# EasyEDA schematic SCH_Gateway.json
TITLE: Gateway Schematic; REV: 1.0; Date: 2024-02-15; Sheet: 1/1; Drawn By: Ashley Kanyatte; Company: University of Regina
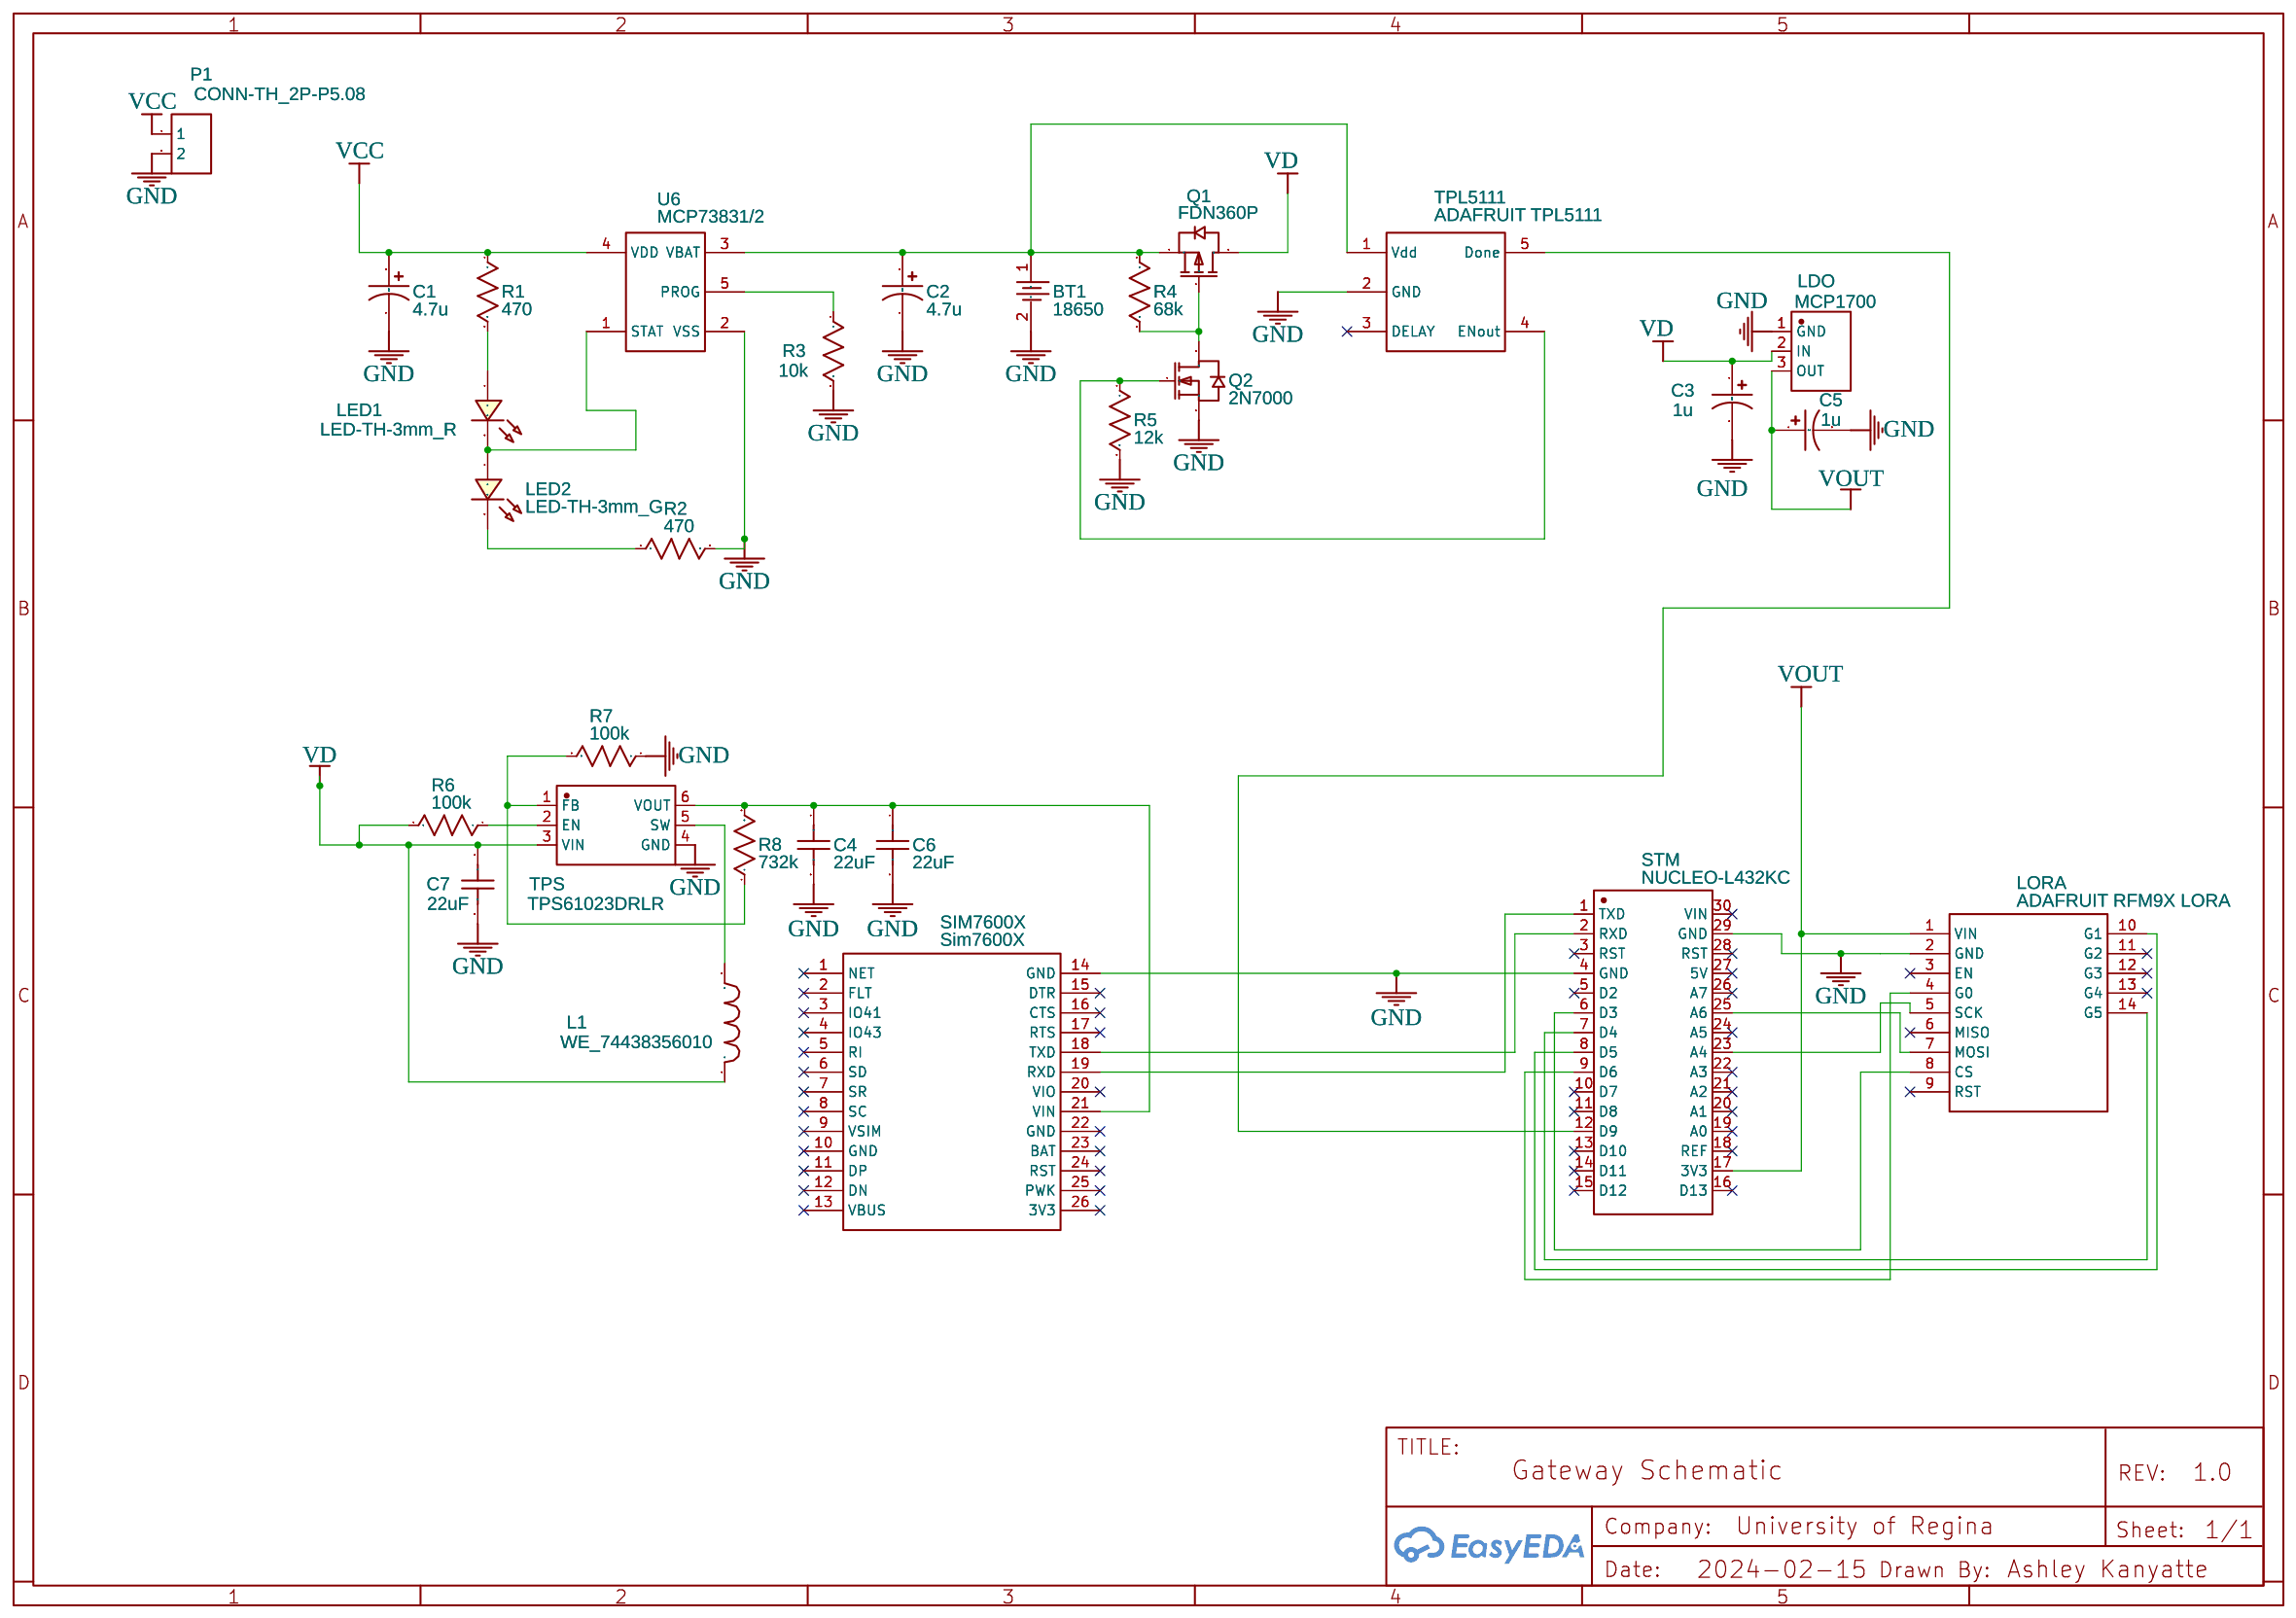
[diagram p0: schematic sheet]

## Parts
BT1  18650  [BAT-TH_18650-A5BJ001]
C1  4.7u  [CAP-D5.0×F2.0]
C2  4.7u  [CAP-D5.0×F2.0]
C3  1u  [CAP-D5.0×F2.0]
C4  22uF  [CAP-TH_L5.5-W4.0-P5.00-D0.5]
C5  1u  [CAP-D5.0×F2.0]
C6  22uF  [CAP-TH_L5.5-W4.0-P5.00-D0.5]
C7  22uF  [CAP-TH_L5.5-W4.0-P5.00-D0.5]
L1  WE_74438356010  [IND-SMD_L4.1-W4.1_74438356010]
LDO  MCP1700  [TO-92-3_L5.1-W4.1-P1.27-L]
LED1  LED-TH-3mm_R  [LED-TH_BD3.0_RED]
LED2  LED-TH-3mm_G  [LED-TH_BD3.0_GREEN]
LORA  ADAFRUIT RFM9X LORA  [ADAFRUIT RFM9X LORA RADIO]
P1  CONN-TH_2P-P5.08  [CONN-TH_2P-P5.08]
Q1  FDN360P  [SOT-23-3_L2.9-W1.6-P1.90-LS2.8-BR]
Q2  2N7000  [TO-92-3_L4.9-W3.7-P1.27-L]
R1  470  [R_AXIAL-0.4]
R2  470  [R_AXIAL-0.4]
R3  10k  [R_AXIAL-0.4]
R4  68k  [R_AXIAL-0.4]
R5  12k  [R_AXIAL-0.4]
R6  100k  [R_AXIAL-0.4]
R7  100k  [R_AXIAL-0.4]
R8  732k  [R_AXIAL-0.4]
SIM7600X  Sim7600X  [SIM7600X]
STM  NUCLEO-L432KC  [DIP-30_L51.0-W17.8-P2.54-LS15.2-TL]
TPL5111  ADAFRUIT TPL5111  [TPL5111]
TPS  TPS61023DRLR  [SOT-563_L1.6-W1.2-P0.50-LS1.6-BR]
U6  MCP73831/2  [MCP73831T-2ACI/OT]

## Library data of the parts
BT1 = BH-18650-A5BJ001: Supplier: LCSC; Supplier Part: C5383220; Manufacturer: MYOUNG(美阳); Contributor: lcsc; JLCPCB Part Class: Extended Part
C1-C3 C5 = CE_TH_D5.0×F2.0_US: Contributor: LCEDA_Lib
C4 C6 C7 = RDEC71E226K3K1H03B: Contributor: LCSC; Supplier: LCSC; Supplier Part: C1620469; Manufacturer: muRata(村田); JLCPCB Part Class: Extended Part
L1 = WE_74438356010: Manufacturer: Wurth Elektronik; Manufacturer Part: 74438356010; Supplier: Digi-Key; Supplier Part: 74438356018; link: https://www.digikey.ca/en/products/detail/w%C3%BCrth-elektronik/74438356010/5725343; Contributor: kanyatteashley
LDO = MCP1700-3302E/TO: Contributor: LCSC; Supplier: LCSC; Supplier Part: C511277; Manufacturer: MICROCHIP(美国微芯); JLCPCB Part Class: Extended Part
LED1 = LED-TH-3mm_R: Manufacturer: EVERLIGHT(台湾亿光); Manufacturer Part: 204-10SDRD/S530-A3-L; Supplier Part: C84774; Supplier: LCSC; Contributor: LCEDA_Lib
LED2 = LED-TH-3mm_G: Manufacturer: EVERLIGHT(台湾亿光); Manufacturer Part: 204-10SYGD/S530-E3; Supplier Part: C85161; Contributor: LCEDA_Lib
LORA = ADAFRUIT RFM9X LORA: Manufacturer: Adafruit; Manufacturer Part: 3072; Supplier: Adafruit; Supplier Part: 3072; link: https://www.adafruit.com/product/3072; Contributor: marty.sweet
P1 = CONN-TH_2P-P5.08: Supplier: LCSC; Contributor: LCEDA_Lib
Q1 = FDN360P: Contributor: LCSC; Supplier: LCSC; Supplier Part: C124463; Manufacturer: onsemi(安森美); JLCPCB Part Class: Extended Part
Q2 = 2N7000: Supplier: LCSC; Manufacturer: CJ(江苏长电/长晶); Supplier Part: C9114; JLCPCB Part Class: Extended Part
R1-R8 = R_AXIAL-0.4_US: Contributor: LCEDA_Lib
SIM7600X = Sim7600X: Supplier: Waveshare; link: https://www.waveshare.com/sim7600g-h-4g-module.htm; Contributor: Guest
STM = NUCLEO-L432KC: Supplier: LCSC; Manufacturer: ST(意法半导体); Supplier Part: C94814
TPL5111 = ADAFRUIT TPL5111: Manufacturer Part: 3435; Supplier Part: 3435; Supplier: Adafruit; link: https://learn.adafruit.com/adafruit-tpl5110-power-timer-breakout?view=all; Contributor: Sdobout
TPS = TPS61023DRLR: Contributor: LCSC; Supplier: LCSC; Supplier Part: C919459; Manufacturer: TI(德州仪器); JLCPCB Part Class: Extended Part
U6 = MCP73831/2: Manufacturer: Microchip; Supplier: RS-Online; link: https://docs.rs-online.com/0798/0900766b814adab7.pdf; Contributor: 김동환

## Nets
GND: BT1.2 C1.2 C2.2 C3.2 C4.2 C5.2 C6.2 C7.2 LDO.1(GND) LORA.2(GND) P1.2 Q2.1(S) R2.2 R3.2 R5.2 R7.1 SIM7600X.14(GND) STM.4(GND) STM.29(GND) TPL5111.2(GND) TPS.4(GND) U6.2(VSS)
VCC: C1.1 P1.1 R1.1 U6.4(VDD)
VD: C3.1 C7.1 L1.2 LDO.2(IN) Q1.3(D) R6.2 TPS.3(VIN)
VOUT: C5.1 LDO.3(OUT) LORA.1(VIN) STM.17(3V3)
Net-(BT1-1): BT1.1 C2.1 Q1.2(S) R4.1 TPL5111.1(Vdd) U6.3(VBAT)
Net-(C4-1): C4.1 C6.1 R8.2 SIM7600X.21(VIN) TPS.6(VOUT)
Net-(L1-1): L1.1 TPS.5(SW)
Net-(LED1-1): LED1.1 R1.2
Net-(LED1-2): LED1.2 LED2.1 U6.1(STAT)
Net-(LED2-2): LED2.2 R2.1
Net-(LORA-4): LORA.4(G0) STM.9(D6)
Net-(LORA-5): LORA.5(SCK) STM.23(A4)
Net-(LORA-7): LORA.7(MOSI) STM.25(A6)
Net-(LORA-8): LORA.8(CS) STM.6(D3)
Net-(LORA-10): LORA.10(G1) STM.8(D5)
Net-(LORA-14): LORA.14(G5) STM.7(D4)
Net-(Q1-1): Q1.1(G) Q2.3(D) R4.2
Net-(Q2-2): Q2.2(G) R5.1 TPL5111.4(ENout)
Net-(R3-1): R3.1 U6.5(PROG)
Net-(R6-1): R6.1 TPS.2(EN)
Net-(R7-2): R7.2 R8.1 TPS.1(FB)
Net-(SIM7600X-18): SIM7600X.18(TXD) STM.2(RXD)
Net-(SIM7600X-19): SIM7600X.19(RXD) STM.1(TXD)
Net-(STM-12): STM.12(D9) TPL5111.5(Done)

Not connected (* = marked no-connect by the designer): LORA 3(EN)* 6(MISO)* 9(RST)* 11(G2)* 12(G3)* 13(G4)*; SIM7600X 1(NET)* 2(FLT)* 3(IO41)* 4(IO43)* 5(RI)* 6(SD)* 7(SR)* 8(SC)* 9(VSIM)* 10(GND)* 11(DP)* 12(DN)* 13(VBUS)* 15(DTR)* 16(CTS)* 17(RTS)* 20(VIO)* 22(GND)* 23(BAT)* 24(RST)* 25(PWK)* 26(3V3)*; STM 3(RST)* 5(D2)* 10(D7)* 11(D8)* 13(D10)* 14(D11)* 15(D12)* 16(D13)* 18(REF)* 19(A0)* 20(A1)* 21(A2)* 22(A3)* 24(A5)* 26(A7)* 27(5V)* 28(RST)* 30(VIN)*; TPL5111 3(DELAY)*
